# EAGLE design touch_ff3_ext (EAGLE 7.5.0)
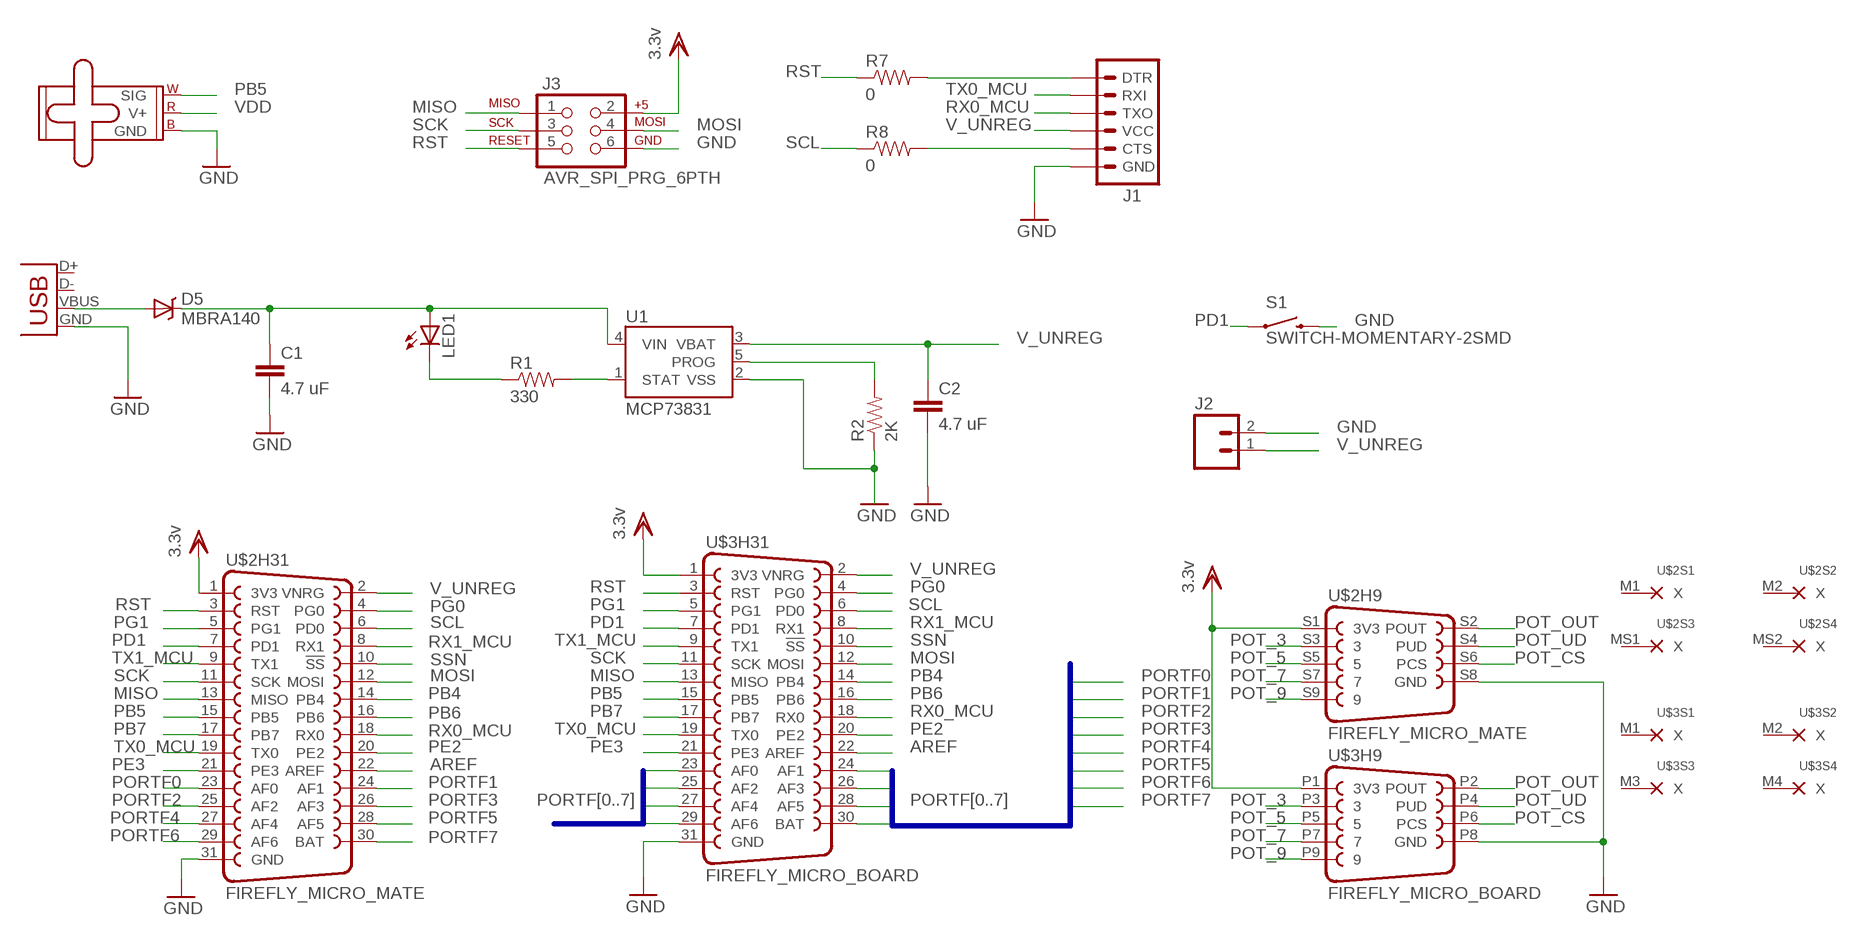
[diagram p0: schematic, sheet 1]

## Parts
C1  4.7 uF  CAP1206  [1206]
C2  4.7 uF  CAP1206  [1206]
D5  MBRA140  [SMA-DIODE]
J1  ARDUINO_SERIAL_PROGRAMPTH  [1X06]
J2  M02PTH  [1X02]
J3  AVR_SPI_PRG_6PTH  [2X3]
LED1  LED1206  [LED-1206]
M1  SMALL_SERVO  [1X03]
R1  330  RESISTOR1206  [1206]
R2  2K  RESISTOR1206  [1206]
R7  0  RESISTOR1206  [1206]
R8  0  RESISTOR1206  [1206]
S1  SWITCH-MOMENTARY-2SMD  [TACTILE-SWITCH-SMD]
U1  MCP73831  [SOT23-5]
U$2  FIREFLY_MICRO_MATE  [FIREFLY_MICRO_MATE]
U$3  FIREFLY_MICRO_BOARD  [FIREFLY_MICRO_BOARD]
X1  USBSMD  [USB-MINIB]

## Nets
AREF: U$2.22(H31:AREF) U$3.22(H31:AREF)
GND: C1.2 C2.2 J1.6(GND) J2.2 J3.6 M1.3(GND) S1.3 U$2.31(H31:GND) U$2.S8(H9:GND) U$3.31(H31:GND) U$3.P8(H9:GND) X1.GND
MISO: J3.1 U$2.13(H31:MISO) U$3.13(H31:MISO)
MOSI: J3.4 U$2.12(H31:MOSI) U$3.12(H31:MOSI)
N$1: R2.1 U1.2(VSS)
N$6: C1.1 D5.C LED1.A U1.4(VIN)
N$7: R1.2 U1.1(STAT)
N$9: LED1.C R1.1
N$10: D5.A X1.VBUS
N$17: R2.2 U1.5(PROG)
N$18: J1.1(DTR) R7.2
N$19: J1.5(CTS) R8.2
PB4: U$2.14(H31:PB4) U$3.14(H31:PB4)
PB5: M1.1(SIG) U$2.15(H31:PB5) U$3.15(H31:PB5)
PB6: U$2.16(H31:PB6) U$3.16(H31:PB6)
PB7: U$2.17(H31:PB7) U$3.17(H31:PB7)
PD1: S1.1 U$2.7(H31:PD1) U$3.7(H31:PD1)
PE2: U$2.20(H31:PE2) U$3.20(H31:PE2)
PE3: U$2.21(H31:PE3) U$3.21(H31:PE3)
PG0: U$2.4(H31:PG0) U$3.4(H31:PG0)
PG1: U$2.5(H31:PG1) U$3.5(H31:PG1)
PORTF0: U$2.23(H31:AF0) U$3.23(H31:AF0)
PORTF1: U$2.24(H31:AF1) U$3.24(H31:AF1)
PORTF2: U$2.25(H31:AF2) U$3.25(H31:AF2)
PORTF3: U$2.26(H31:AF3) U$3.26(H31:AF3)
PORTF4: U$2.27(H31:AF4) U$3.27(H31:AF4)
PORTF5: U$2.28(H31:AF5) U$3.28(H31:AF5)
PORTF6: U$2.29(H31:AF6) U$3.29(H31:AF6)
PORTF7: U$2.30(H31:BAT) U$3.30(H31:BAT)
POT_3: U$2.S3 U$3.P3
POT_5: U$2.S5 U$3.P5
POT_7: U$2.S7 U$3.P7
POT_9: U$2.S9 U$3.P9
POT_CS: U$2.S6(H9:PCS) U$3.P6(H9:PCS)
POT_OUT: U$2.S2(H9:POUT) U$3.P2(H9:POUT)
POT_UD: U$2.S4(H9:PUD) U$3.P4(H9:PUD)
RST: J3.5 R7.1 U$2.3(H31:RST) U$3.3(H31:RST)
RX0_MCU: J1.3(TXO) U$2.18(H31:RX0) U$3.18(H31:RX0)
RX1_MCU: U$2.8(H31:RX1) U$3.8(H31:RX1)
SCK: J3.3 U$2.11(H31:SCK) U$3.11(H31:SCK)
SCL: R8.1 U$2.6(H31:PD0) U$3.6(H31:PD0)
SSN: U$2.10(H31:!SS) U$3.10(H31:!SS)
TX0_MCU: J1.2(RXI) U$2.19(H31:TX0) U$3.19(H31:TX0)
TX1_MCU: U$2.9(H31:TX1) U$3.9(H31:TX1)
V_UNREG: C2.1 J1.4(VCC) J2.1 U1.3(VBAT) U$2.2(H31:VNRG) U$3.2(H31:VNRG)
VDD: J3.2 M1.2(V+) U$2.1(H31:3V3) U$2.S1(H9:3V3) U$3.1(H31:3V3) U$3.P1(H9:3V3) ; supply symbol labelled 3.3v
Unconnected: U$2.M1(S1:X) U$2.M2(S2:X) U$2.MS1(S3:X) U$2.MS2(S4:X) U$3.M1(S1:X) U$3.M2(S2:X) U$3.M3(S3:X) U$3.M4(S4:X) X1.D+ X1.D-

## Buses
PORTF[0..7]

## Library data of the parts
C1 C2 = SparkFun-Capacitors:CAP: Capacitor Standard 0603 ceramic capacitor, and 0.1" leaded capacitor.
D5 = SparkFun-DiscreteSemi:MBRA140: 40V, 1A Schottky rectifier SMA/DO-214AC package DIO-08053; PROD_ID: DIO-08053
J1 = SparkFun-Connectors:ARDUINO_SERIAL_PROGRAM: FTDI connector footprints
J2 = SparkFun-Connectors:M02: Standard 2-pin 0.1" header. Use with - straight break away headers ( PRT-00116) - right angle break away headers (PRT-00553) - swiss pins (PRT-00743) - machine pins (PRT-00117) - female headers (PRT-00115) Molex polarized connector foot print use with: PRT-08233 with associated crimp pins and housings. 2.54_SCREWTERM for use with PRT-10571. 3.5mm Screw Terminal footprints for PRT-08084 5mm Screw Terminal footprints for use with PRT-08432
J3 = SparkFun-Connectors:AVR_SPI_PRG_6: AVR ISP 6 Pin This is the reduced ISP connector for AVR programming. Common on Arduino. This footprint will take up less PCB space and can be used with a 10-pin to 6-pin adapter such as SKU: BOB-08508 **Special note about "TEST_POINT" package. The stop mask is on the top side, so if you want your programming test points to be on the bottom of your board, make sure to place this package on the bottom side of the board. This also ensure that the orientation to program from the bottom side will be correct.
LED1 = LilyPad-Wearables:LED: LEDs Standard schematic elements and footprints for 5mm, 3mm, 1206, and 0603 sized LEDs. 5mm - Spark Fun Electronics SKU : Comp-SBL
M1 = SparkFun-Electromechanical:SMALL_SERVO: Small servo motor This is the small servo used in the SIK. SKU: ROB-09065
R1 R2 = SparkFun-Resistors:RESISTOR: Resistor Basic schematic elements and footprints for 0603, 1206, and PTH resistors.
R7 R8 = SparkFun-Passives:RESISTOR: Resistor Basic schematic elements and footprints for 0603, 1206, and PTH resistors.
S1 = SparkFun-Electromechanical:SWITCH-MOMENTARY-2: Various NO switches- pushbuttons, reed, etc; PROD_ID: SWCH-08247
U1 = SparkFun-PowerIC:MCP73831: Miniature single cell, fully integrated Li-Ion, Li-polymer charge management controller http://ww1.microchip.com/downloads/en/DeviceDoc/21984a.pdf IC-09995; PROD_ID: IC-09995
U$2 = Boards:FIREFLY: Addon Board for Firefly Sensor Nodes This version is compliant with Firefly Micro powered by Atmel Atmega128RFA1. Connectors on female gender match those on Firefly Micro Board. Connectors on male gender mate with Firefly Micro Board. Use these for addons.; GENDER: Male
U$3 = Boards:FIREFLY: Addon Board for Firefly Sensor Nodes This version is compliant with Firefly Micro powered by Atmel Atmega128RFA1. Connectors on female gender match those on Firefly Micro Board. Connectors on male gender mate with Firefly Micro Board. Use these for addons.; GENDER: Female
X1 = SparkFun-Connectors:USB: USB Connectors USB-B-PTH is fully proven SKU : PRT-00139/CONN-08278 USB-miniB is fully proven SKU : PRT-00587 USB-A-PCB is untested. USB-A-H is throughly reviewed, but untested. Spark Fun Electronics SKU : PRT-00437 USB-B-SMT is throughly reviewed, but untested. Needs silkscreen touching up. USB-A-S has not been used/tested USB-MB-H has not been used/tested USB-MICROB has been used. CONN-09505

## Board
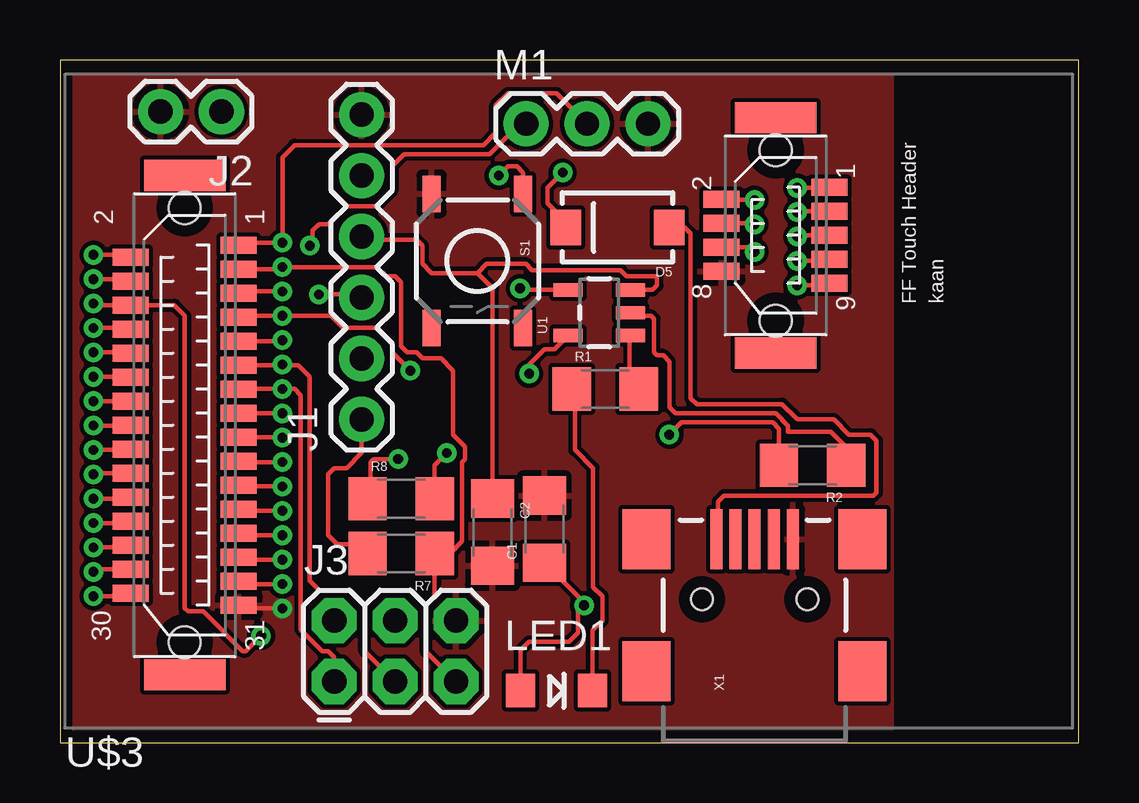
[diagram p1: board, top side]
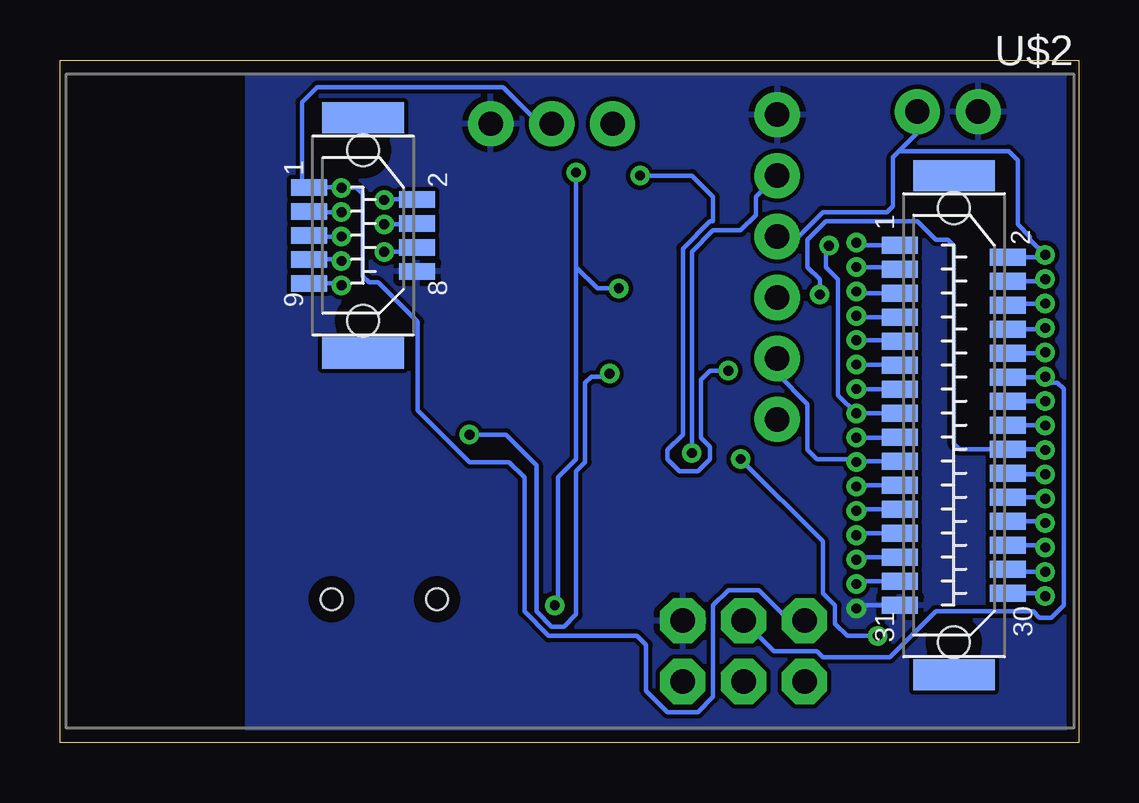
[diagram p2: board, bottom side, seen from below]

Size 42.47 x 28.44 mm. Coordinates in mm from the lower left corner, seen from the top.
Outline: 0,0 42.47,0 42.47,28.44 0,28.44 0,0
Copper layers (1*16): Top 0.035mm / dielectric 1.5mm / Bottom 0.035mm
Design rules "default *": minimum track width 7mil, minimum drill 16mil, track to track 7mil, track to pad 7mil, pad to pad 7mil, via to via 7mil, smd to smd 7mil, copper to edge 20mil, drill to drill 8mil, minimum pad ring 10mil, minimum via ring 8mil, stop-mask expansion 4mil, vias tented up to drill 0mil, thermal gap 10mil

### Footprints (pad centres in the part's own frame; a part is rotated, then mirrored left to right if it is on the bottom)
1206 = smd 1.6 x 1.8: 1 -1.4,0; 2 1.4,0
SMA-DIODE = smd 1.27 x 1.47: A -2.15,0; C 2.15,0
1X06 = drill 1.016 pad 1.88: 1 0,0; 2 2.54,0; 3 5.08,0; 4 7.62,0; 5 10.16,0; 6 12.7,0
1X02 = drill 1.016 pad 1.88: 1 0,0; 2 2.54,0
2X3 = drill 1.016 pad 1.88 octagon: 1 0,0; 2 0,2.54; 3 2.54,0; 4 2.54,2.54; 5 5.08,0; 6 5.08,2.54
LED-1206 = smd 1.2 x 1.4: A -1.5,0; C 1.5,0
1X03 = drill 1.016 pad 1.88: 1 0,0; 2 2.54,0; 3 5.08,0
TACTILE-SWITCH-SMD = smd 1.524 x 0.762: 1 -2.794,1.905; 2 2.794,1.905; 3 -2.794,-1.905; 4 2.794,-1.905
SOT23-5 = smd 0.55 x 1.2: 1 -0.95,-1.3; 2 0,-1.3; 3 0.95,-1.3; 4 0.95,1.3; 5 -0.95,1.3
FIREFLY_MICRO_MATE = smd 1.5 x 0.7: 1 -13.758,-6.497; 2 -18.258,-5.997; 3 -13.758,-5.497; 4 -18.258,-4.997; 5 -13.758,-4.497; 6 -18.258,-3.997; 7 -13.758,-3.497; 8 -18.258,-2.997; 9 -13.758,-2.497; 10 -18.258,-1.997; 11 -13.758,-1.497; 12 -18.258,-0.997; 13 -13.758,-0.497; 14 -18.258,0.003; 15 -13.758,0.503; 16 -18.258,1.003; 17 -13.758,1.503; 18 -18.258,2.003; 19 -13.758,2.503; 20 -18.258,3.003; 21 -13.758,3.503; 22 -18.258,4.003; 23 -13.758,4.503; 24 -18.258,5.003; 25 -13.758,5.503; 26 -18.258,6.003; 27 -13.758,6.503; 28 -18.258,7.003; 29 -13.758,7.503; 30 -18.258,8.003; 31 -13.758,8.503; S1 10.874,-8.905; S2 6.374,-8.405; S3 10.874,-7.905; S4 6.374,-7.405; S5 10.874,-6.905; S6 6.374,-6.405; S7 10.874,-5.905; S8 6.374,-5.405; S9 10.874,-4.905 | smd 3.4 x 1.3: M1 -16.008,-9.397; M2 -16.008,11.403; MS1 8.624,-11.805; MS2 8.624,-2.005 | hole 1.321: -16.008,-8.047; -16.008,10.053; 8.624,-10.455; 8.624,-3.355
FIREFLY_MICRO_BOARD = smd 1.5 x 0.7: 1 -13.758,6.499; 2 -18.258,5.999; 3 -13.758,5.499; 4 -18.258,4.999; 5 -13.758,4.499; 6 -18.258,3.999; 7 -13.758,3.499; 8 -18.258,2.999; 9 -13.758,2.499; 10 -18.258,1.999; 11 -13.758,1.499; 12 -18.258,0.999; 13 -13.758,0.499; 14 -18.258,-0.001; 15 -13.758,-0.501; 16 -18.258,-1.001; 17 -13.758,-1.501; 18 -18.258,-2.001; 19 -13.758,-2.501; 20 -18.258,-3.001; 21 -13.758,-3.501; 22 -18.258,-4.001; 23 -13.758,-4.501; 24 -18.258,-5.001; 25 -13.758,-5.501; 26 -18.258,-6.001; 27 -13.758,-6.501; 28 -18.258,-7.001; 29 -13.758,-7.501; 30 -18.258,-8.001; 31 -13.758,-8.501; P1 10.874,8.907; P2 6.374,8.407; P3 10.874,7.907; P4 6.374,7.407; P5 10.874,6.907; P6 6.374,6.407; P7 10.874,5.907; P8 6.374,5.407; P9 10.874,4.907 | smd 3.4 x 1.3: M1 8.624,11.807; M2 8.624,2.007; M3 -16.008,-11.401; M4 -16.008,9.399 | hole 1.321: -16.008,-10.051; -16.008,8.049; 8.624,3.357; 8.624,10.457
USB-MINIB = smd 2.5 x 0.5: D+ 2.5,0; D- 2.5,0.8; GND 2.5,-1.6; ID 2.5,-0.8; VBUS 2.5,1.6 | smd 2.5 x 2: MTN1 -3,4.5; MTN2 2.5,4.5; MTN3 -3,-4.5; MTN4 2.5,-4.5 | hole 0.9: 0,2.2; 0,-2.2

### Placement (x,y rotation side)
C1  20.19,8.89 90 top
C2  18.03,8.76 270 top
D5  23.24,21.46 180 top
J1  12.57,13.46 90 top
J2  6.73,26.29 180 top
J3  11.43,2.54 0 top
LED1  20.7,2.16 0 top
M1  19.43,25.78 0 top
R1  22.73,14.73 0 top
R2  31.37,11.56 180 top
R7  14.22,7.87 180 top
R8  14.22,10.16 0 top
S1  17.4,20.07 270 top
U1  22.48,17.91 90 top
U$2  21.21,14.22 180 bottom
U$3  21.21,14.22 0 top
X1  28.96,5.97 90 top

### Tracks (layer width: path | path; a pad name or v marks a point on that pad's centre or on a via)
AREF  (via drill 0.41 pad 0.51)
  Top 0.178: v1.4,10.16 2.89,10.16 U$3.22
  Bottom 0.178: U$3.22 1.46,10.22 v1.4,10.16
GND  (via drill 0.41 pad 0.51)
  Top 0.178: v9.27,5.59 7.58,5.59 U$3.31
  Bottom 0.178: U$3.31 9.14,5.72 v9.27,5.59
  pour Top: -18.16,28.45 -18.16,0 34.67,0 34.67,28.45
  pour Bottom: -18.16,28.45 -18.16,0 34.67,0 34.67,28.45
MISO  (via drill 0.41 pad 0.51)
  Top 0.178: J3.1 11.43,3.56 11.18,3.81 10.92,3.81 10.03,4.7 10.03,14.48 9.78,14.73 v9.27,14.73 U$3.13
  Bottom 0.178: U$3.13 | U$3.13 | U$3.13 v9.26,14.72 v9.27,14.73
MOSI  (via drill 0.41 pad 0.51)
  Top 0.178: v1.4,15.24 2.93,15.24 U$3.12
  Bottom 0.178: U$3.12 1.42,15.22 v1.4,15.24 1.14,14.99 0.89,14.99 0.64,14.73 0.64,5.71 1.14,5.21 1.65,5.21 1.91,5.46 5.97,5.46 7.87,3.56 10.67,3.56 10.92,3.81 12.7,3.81 J3.4
N$1
  Top 0.178: R2.1 32.89,11.56 32.89,12.19 32.13,12.95 30.35,12.95 30.35,13.21 29.85,13.72 25.65,13.72 25.4,13.97 25.4,15.88 25.15,16.13 24.89,16.13 24.77,16.26 24.77,17.65 24.64,17.78 23.91,17.78 U1.2
N$6  (via drill 0.41 pad 0.51)
  Top 0.178: D5.C 21.09,21.71 20.32,22.48 20.32,23.11 v20.96,23.75 | C1.1 21.84,5.84 v21.84,5.71 21.59,5.46 21.59,4.57 21.21,4.19 19.56,4.19 19.2,3.83 LED1.A | U1.4 19.24,18.86 v19.18,18.92
  Bottom 0.178: v20.96,23.75 20.96,19.81 | 20.96,19.81 20.96,11.81 21.72,11.05 21.72,5.84 v21.84,5.71 | v19.18,18.92 20.07,18.92 20.96,19.81
N$7
  Top 0.178: U1.1 23.78,16.92 23.75,16.89 23.75,15.12 R1.2
N$9
  Top 0.178: LED1.C 22.2,4.68 22.61,5.08 22.61,6.1 22.22,6.48 22.22,11.43 21.46,12.19 21.46,14.6 R1.1
N$10
  Top 0.178: D5.A 26.04,21.46 26.29,21.21 26.29,14.35 26.54,14.1 30.1,14.1 30.73,13.46 32.26,13.46 32.89,12.83 33.78,12.83 34.04,12.57 34.04,10.41 33.91,10.29 27.69,10.29 27.43,10.03 27.43,8.55 X1.VBUS
N$17  (via drill 0.41 pad 0.51)
  Top 0.178: R2.2 29.97,11.68 29.97,13.08 29.72,13.34 25.91,13.34 v25.4,12.83 | 21.08,16.86 U1.5 20.61,16.38 20.19,16.38 19.56,15.75 v19.56,15.37
  Bottom 0.178: v25.4,12.83 23.88,12.83 22.61,11.56 22.61,5.46 21.97,4.83 21.46,4.83 20.96,5.33 20.96,11.3 20.57,11.68 20.57,14.99 20.32,15.24 19.68,15.24 v19.56,15.37
N$18
  Top 0.178: J1.1 12.57,12.07 11.94,11.43 11.43,11.43 11.18,11.18 11.18,8.64 11.56,8.25 12.44,8.25 R7.2
N$19  (via drill 0.41 pad 0.51)
  Top 0.178: R8.2 15.62,11.56 v16.13,12.07
  Bottom 0.178: v16.13,12.07 16.13,20.45 15.24,21.34 14.1,21.34 13.46,21.97 13.46,22.73 J1.5
PB4  (via drill 0.41 pad 0.51)
  Top 0.178: U$3.14 v1.4,14.22
  Bottom 0.178: v1.4,14.22 U$3.14
PB5  (via drill 0.41 pad 0.51)
  Top 0.178: v9.27,13.72 U$3.15 | M1.1 19.18,25.78 17.91,24.51 14.35,24.51 13.84,24 13.84,22.99 13.21,22.35 11.94,22.35 11.18,21.59 10.79,21.59 10.54,21.34 10.54,20.83 v10.41,20.7
  Bottom 0.178: U$3.15 v9.27,13.72 10.03,14.48 10.03,19.3 10.54,19.81 10.54,20.57 v10.41,20.7
PB6  (via drill 0.41 pad 0.51)
  Top 0.178: v1.4,13.21 2.94,13.21 U$3.16
  Bottom 0.178: U$3.16 1.41,13.22 v1.4,13.21
PB7  (via drill 0.41 pad 0.51)
  Top 0.178: U$3.17 9.25,12.72 v9.27,12.7
  Bottom 0.178: v9.27,12.7 7.47,12.7 U$3.17
PD1  (via drill 0.41 pad 0.51)
  Top 0.178: U$3.7 7.51,17.78 v9.27,17.78 11.3,17.78 11.81,17.27 13.21,17.27 13.84,16.64 13.84,16.26 v14.61,15.49 | 19.43,22.73 S1.1 19.3,23.75 19.05,24 18.67,24 v18.29,23.62
  Bottom 0.178: U$3.7 9.21,17.72 v9.27,17.78 | v18.29,23.62 16.13,23.62 15.24,22.73 15.24,21.72 15.37,21.72 16.51,20.57 16.51,12.83 17.14,12.19 17.14,11.81 16.64,11.3 15.88,11.3 15.37,11.81 15.37,12.32 15.75,12.7 15.75,15.11 15.37,15.49 v14.61,15.49
PE2  (via drill 0.41 pad 0.51)
  Top 0.178: U$3.20 1.44,11.22 v1.4,11.18
  Bottom 0.178: v1.4,11.18 2.91,11.18 U$3.20
PE3  (via drill 0.41 pad 0.51)
  Top 0.178: v9.27,10.67 7.5,10.67 U$3.21
  Bottom 0.178: U$3.21 9.22,10.72 v9.27,10.67
PG0  (via drill 0.41 pad 0.51)
  Top 0.178: v1.4,19.3 2.87,19.3 U$3.4
  Bottom 0.178: U$3.4 1.48,19.22 v1.4,19.3
PG1  (via drill 0.41 pad 0.51)
  Top 0.178: v9.27,18.8 7.52,18.8 U$3.5
  Bottom 0.178: U$3.5 9.2,18.72 v9.27,18.8
PORTF0  (via drill 0.41 pad 0.51)
  Top 0.178: v9.27,9.65 7.52,9.65 U$3.23
  Bottom 0.178: U$3.23 9.2,9.72 v9.27,9.65
PORTF1  (via drill 0.41 pad 0.51)
  Top 0.178: v1.4,9.14 2.87,9.14 U$3.24
  Bottom 0.178: U$3.24 1.47,9.22 v1.4,9.14
PORTF2  (via drill 0.41 pad 0.51)
  Top 0.178: v9.27,8.64 7.54,8.64 U$3.25
  Bottom 0.178: U$3.25 9.19,8.72 v9.27,8.64
PORTF3  (via drill 0.41 pad 0.51)
  Top 0.178: v1.4,8.13 2.86,8.13 U$3.26
  Bottom 0.178: U$3.26 1.49,8.22 v1.4,8.13
PORTF4  (via drill 0.41 pad 0.51)
  Top 0.178: v9.27,7.62 7.55,7.62 U$3.27
  Bottom 0.178: U$3.27 9.17,7.72 v9.27,7.62
PORTF5  (via drill 0.41 pad 0.51)
  Top 0.178: U$3.28 1.51,7.22 v1.4,7.11
  Bottom 0.178: v1.4,7.11 2.84,7.11 U$3.28
PORTF6  (via drill 0.41 pad 0.51)
  Top 0.178: v9.27,6.6 7.57,6.6 U$3.29
  Bottom 0.178: U$3.29 9.15,6.72 v9.27,6.6
PORTF7  (via drill 0.41 pad 0.51)
  Top 0.178: v1.4,6.1 2.82,6.1 U$3.30
  Bottom 0.178: U$3.30 1.52,6.22 v1.4,6.1
POT_3  (via drill 0.41 pad 0.51)
  Top 0.178: U$3.P3 30.77,22.13 v30.73,22.1
  Bottom 0.178: v30.73,22.1 32.05,22.1 U$3.P3
POT_5  (via drill 0.41 pad 0.51)
  Top 0.178: U$3.P5 30.78,21.13 v30.73,21.08
  Bottom 0.178: v30.73,21.08 32.04,21.08 U$3.P5
POT_7  (via drill 0.41 pad 0.51)
  Top 0.178: v30.73,20.07 32.02,20.07 U$3.P7
  Bottom 0.178: U$3.P7 30.8,20.13 v30.73,20.07
POT_9  (via drill 0.41 pad 0.51)
  Top 0.178: v30.73,19.05 32,19.05 U$3.P9
  Bottom 0.178: U$3.P9 30.81,19.13 v30.73,19.05
POT_CS  (via drill 0.41 pad 0.51)
  Top 0.178: U$3.P6 28.77,20.63 v28.96,20.45
  Bottom 0.178: v28.96,20.45 27.77,20.45 U$3.P6
POT_OUT  (via drill 0.41 pad 0.51)
  Top 0.178: v28.96,22.61 27.58,22.61 U$3.P2
  Bottom 0.178: U$3.P2 28.96,22.63 v28.96,22.61
POT_UD  (via drill 0.41 pad 0.51)
  Top 0.178: U$3.P4 28.96,21.63 v28.96,21.59
  Bottom 0.178: v28.96,21.59 27.58,21.59 U$3.P4
RST  (via drill 0.41 pad 0.51)
  Top 0.178: U$3.3 9.18,19.72 v9.27,19.81 13.21,19.81 13.59,19.43 13.97,19.43 14.22,19.18 14.22,16.51 14.48,16.26 14.86,16.26 15.11,16 15.88,16 16.38,15.49 16.38,12.83 16.89,12.32 16.89,11.81 16.76,11.68 16.76,8.38 16.26,7.87 R7.1 15.62,6.1 15.24,5.71 15.24,3.81 J3.5
  Bottom 0.178: v9.27,19.81 7.54,19.81 U$3.3
RX0_MCU  (via drill 0.41 pad 0.51)
  Top 0.178: v1.4,12.19 2.92,12.19 U$3.18 | J1.3 12.45,18.67 v10.79,18.67
  Bottom 0.178: v1.4,12.19 1.43,12.22 U$3.18 4.98,12.22 5.21,12.45 5.21,20.7 5.46,20.96 5.97,20.96 6.73,21.72 10.54,21.72 11.3,20.96 11.3,19.81 10.79,19.3 v10.79,18.67
RX1_MCU  (via drill 0.41 pad 0.51)
  Top 0.178: v1.4,17.27 2.9,17.27 U$3.8
  Bottom 0.178: U$3.8 1.45,17.22 v1.4,17.27
SCK  (via drill 0.41 pad 0.51)
  Top 0.178: U$3.11 9.25,15.72 | 9.25,15.72 v9.27,15.75 | J3.3 12.7,3.81 12.7,5.71 12.07,6.35 10.79,6.35 10.41,6.73 10.41,15.24 9.93,15.72 9.25,15.72
  Bottom 0.178: v9.27,15.75 7.48,15.75 U$3.11
SCL  (via drill 0.41 pad 0.51)
  Top 0.178: 2.89,18.29 U$3.6 | U$3.6 1.46,18.22 v1.4,18.29 | 13.21,10.03 13.08,10.16 R8.1 12.95,10.29 12.95,11.68 13.08,11.81 v14.1,11.81 | U$3.6 4.76,18.22 5.21,17.78 5.21,5.59 5.33,5.46 5.97,5.46 7.62,3.81 7.75,3.81 v8.38,4.45
  Bottom 0.178: v1.4,18.29 2.88,18.29 U$3.6 | v14.1,11.81 10.67,8.38 10.67,6.22 10.16,5.71 10.16,4.95 9.65,4.45 v8.38,4.45
SSN  (via drill 0.41 pad 0.51)
  Top 0.178: v1.4,16.26 2.92,16.26 U$3.10
  Bottom 0.178: U$3.10 1.3,16.22 v1.4,16.26
TX0_MCU  (via drill 0.41 pad 0.51)
  Top 0.178: U$3.19 7.49,11.68 v9.27,11.68 9.31,11.72
  Bottom 0.178: U$3.19 9.23,11.72 v9.27,11.68 9.4,11.81 10.92,11.81 11.3,12.19 11.3,14.1 12.57,15.37 J1.2
TX1_MCU  (via drill 0.41 pad 0.51)
  Top 0.178: U$3.9 9.23,16.72 v9.27,16.76
  Bottom 0.178: v9.27,16.76 7.49,16.76 U$3.9
V_UNREG  (via drill 0.41 pad 0.51)
  Top 0.178: v1.4,20.32 2.85,20.32 U$3.2 | U1.3 24.7,18.86 24.89,19.05 24.89,19.43 23.62,19.43 23.37,19.68 19.68,19.68 19.43,19.94 17.78,19.94 17.4,19.56 | 17.4,19.56 15.49,19.56 15.11,19.94 15.11,20.7 14.86,20.96 12.7,20.96 J1.4 | C2.1 18.03,18.92 17.4,19.56
  Bottom 0.178: U$3.2 1.5,20.22 v1.4,20.32 2.03,20.96 2.03,21.08 2.54,21.59 2.54,24.26 2.92,24.64 7.49,24.64 | J1.4 11.68,21.08 10.67,22.1 8,22.1 7.75,22.35 7.75,24.38 7.49,24.64 | J2.1 6.73,25.4 7.49,24.64
VDD  (via drill 0.41 pad 0.51)
  Top 0.178: U$3.1 7.56,20.83 v9.27,20.83 9.27,24.38 9.78,24.89 17.65,24.89 18.16,25.4 18.16,26.54 18.67,27.05 20.7,27.05 M1.2 | v30.73,23.11 32.07,23.11 U$3.P1
  Bottom 0.178: U$3.1 9.16,20.72 v9.27,20.83 | M1.2 22.48,25.78 24,27.31 31.75,27.31 32.39,26.67 32.39,23.43 U$3.P1 30.75,23.13 v30.73,23.11 30.1,23.11 29.85,22.86 29.85,19.43 29.59,19.18 29.21,19.18 27.56,17.53 27.56,13.84 25.4,11.68 23.75,11.68 23.11,11.05 23.11,5.46 22.1,4.45 18.42,4.45 18.03,4.06 18.03,2.16 17.14,1.27 15.88,1.27 15.24,1.91 15.24,5.71 14.61,6.35 13.33,6.35 12.07,5.08 J3.2

### Text on the board
tSilk: FF Touch Header | kaan